# Altium schematic sheet WTC01A05BB.schdoc
size 127 x 101 mm
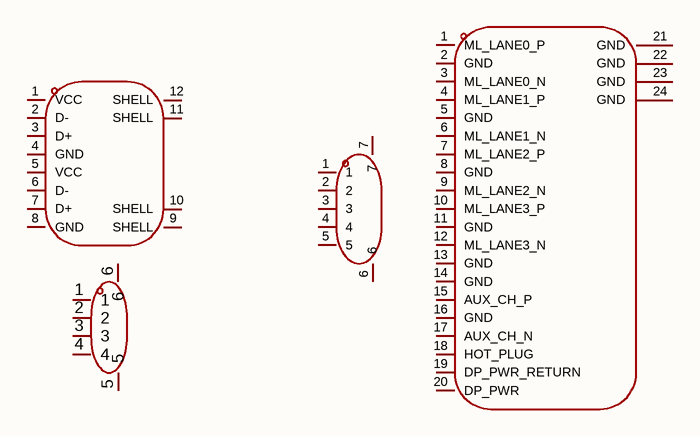
[diagram p0: WTC01A05BB.schdoc]

## Parts
(Parts that share a designator on the sheet are numbered #1, #2 ... from top to bottom, then left to right.)
CN?#1  wtc01a05bb  [CONN-SMD_WTC01A05BB]  (value not drawn)
CN?#2  gh1.25mm-4p-lt  [CONN-SMD_GH1.25MM-4P-LT]  (value not drawn)
USB?#1  af ss-jb17.6  [USB-A-TH_AF-SS-JB17.6]  (value not drawn)
USB?#2  car06-201en5f  [DP-SMD_CAR06-201EN5F]  (value not drawn)

## Nets

Not connected (* = marked no-connect by the designer): CN?#1 1 2 3 4 5 6 7; CN?#2 1 2 3 4 5 6; USB?#1 1(VCC) 2(D-) 3(D+) 4(GND) 5(VCC) 6(D-) 7(D+) 8(GND) 9(SHELL) 10(SHELL) 11(SHELL) 12(SHELL); USB?#2 1(ML_LANE0_P) 2(GND) 3(ML_LANE0_N) 4(ML_LANE1_P) 5(GND) 6(ML_LANE1_N) 7(ML_LANE2_P) 8(GND) 9(ML_LANE2_N) 10(ML_LANE3_P) 11(GND) 12(ML_LANE3_N) 13(GND) 14(GND) 15(AUX_CH_P) 16(GND) 17(AUX_CH_N) 18(HOT_PLUG) 19(DP_PWR_RETURN) 20(DP_PWR) 21(GND) 22(GND) 23(GND) 24(GND)

## Library data of the parts
CN?#1 = wtc01a05bb: 插针结构:1x5P;间距:1.25mm;安装方式:立贴;总PIN数:5P;排数:1;每排PIN数:5;额定电流:1A;触头材质:黄铜;触头镀层:雾锡;工作温度:-40℃~+85℃;; Manufacturer: BZCN(博众电气); AddInBom: yes; Pins Structure: 1x5P; Pitch: 1.25mm; Number of PINs Per Row: 5; Current Rating: 1A; Voltage Rating: 125V; Plastic Material: LCP; Z-Height of the Board: 4.8mm; Y-Width of Bottom Edge on Board: 3.95mm; Symbol: WTC01A05BB; LCSC Part Name: 1x5P 间距:1.25mm 立贴; SupplierPart: C5382984; ManufacturerPart: WTC01A05BB; Supplier Footprint: SMD,P=1.25mm; JLCPCB Part Class: Extended Part; Datasheet: https://item.szlcsc.com/datasheet/WTC01A05BB/6258001.html; Supplier: LCSC; ConvertToPcb: yes; FootprintName: CONN-SMD_WTC01A05BB; Mounting Type: 立贴; Number of Pins: 5P; Number of Rows: 1; Contact Material: 黄铜; Contact Plating: 雾锡; Operating Temperature: -40℃~+85℃; Color: 米色
CN?#2 = gh1.25mm-4p-lt: 插针结构:1x4P;间距:1.25mm;安装方式:立贴;参考系列:GH;总PIN数:4P;排数:1;每排PIN数:4;额定电流:1A;触头材质:磷铜;触头镀层:锡;工作温度:-25℃~+85℃;; Manufacturer: LXWCONN(连兴旺电子); AddInBom: yes; Pins Structure: 1x4P; Pitch: 1.25mm; Reference Series: GH; Number of PINs Per Row: 4; Current Rating: 1A; Voltage Rating: 50V; Plastic Material: LCP; LCSC Part Name: 1x4P 间距:1.25mm 立贴 系列:GH; SupplierPart: C53055373; ManufacturerPart: GH1.25mm-4P-LT; Supplier Footprint: SMD,P=1.25mm; JLCPCB Part Class: Extended Part; Datasheet: https://item.szlcsc.com/datasheet/GH1.25mm-4P-LT/55999573.html; Supplier: LCSC; ConvertToPcb: yes; SymbolName: GH1.25MM-4P-LT; FootprintName: CONN-SMD_GH1.25MM-4P-LT; Mounting Type: 立贴; Number of Pins: 4P; Number of Rows: 1; Contact Material: 磷铜; Contact Plating: 锡; Operating Temperature: -25℃~+85℃
USB?#1 = af ss-jb17.6: 连接器类型:Type-A;协议标准:USB 2.0;公母:母;安装方式:弯插;触点数量:4Px2;端口数量:2;额定电流 - 电源:1.5A;工作温度:-25℃~+85℃;; Manufacturer: SHOU HAN(首韩); AddInBom: yes; ModelId: 8ba1d227017a431299b02e84e92b305a; ModelTransform: 633.987,692.912,0,0,0,0,0.001,-157.952,-157.48; Connector Type: Type-A; Protocol Standard: USB 2.0; Gender: 母; Number of Contacts: 4Px2; Number of Ports: 2; Current Rating-Power: 1.5A; Voltage Rating: 30V; Connect-Disconnect Life: 5千次; Detection color: 白色; Symbol: AF SS-JB17.6; LCSC Part Name: Type-A弯插双层母座; SupplierPart: C456021; ManufacturerPart: AF SS-JB17.6; Supplier Footprint: 弯插; JLCPCB Part Class: Extended Part; Datasheet: https://item.szlcsc.com/datasheet/AF%2520SS-JB17.6/458828.html; Supplier: LCSC; ConvertToPcb: yes; FootprintName: USB-A-TH_AF-SS-JB17.6; ModelName: USB-A-TH_AF-SS-JB17.6; Mounting Type: 弯插; Supplementary Features: -; Center Height: -; Length: 17.6mm; Operating Temperature: -25℃~+85℃
USB?#2 = car06-201en5f: Display port连接器 母座正向平口带柱; Manufacturer: XKB Connection(中国星坤); AddInBom: yes; ModelId: 7f62c199f1984b3893a2b3b0c0c0ad9f; ModelTransform: 729.28838,592.597,0,0,0,0,0,-98.424,-74.803; Symbol: CAR06-201EN5F; LCSC Part Name: CAR06-201EN5F; SupplierPart: C908454; ManufacturerPart: CAR06-201EN5F; Supplier Footprint: SMD; JLCPCB Part Class: Extended Part; Datasheet: https://atta.szlcsc.com/upload/public/pdf/source/20211011/51ABB24801A8C5EF87749AD132E70003.pdf; Supplier: LCSC; ConvertToPcb: yes; FootprintName: DP-SMD_CAR06-201EN5F; ModelName: DP-SMD_CAR06-201EN5F